# EAGLE design BoardAttiny (EAGLE 9.4.1)
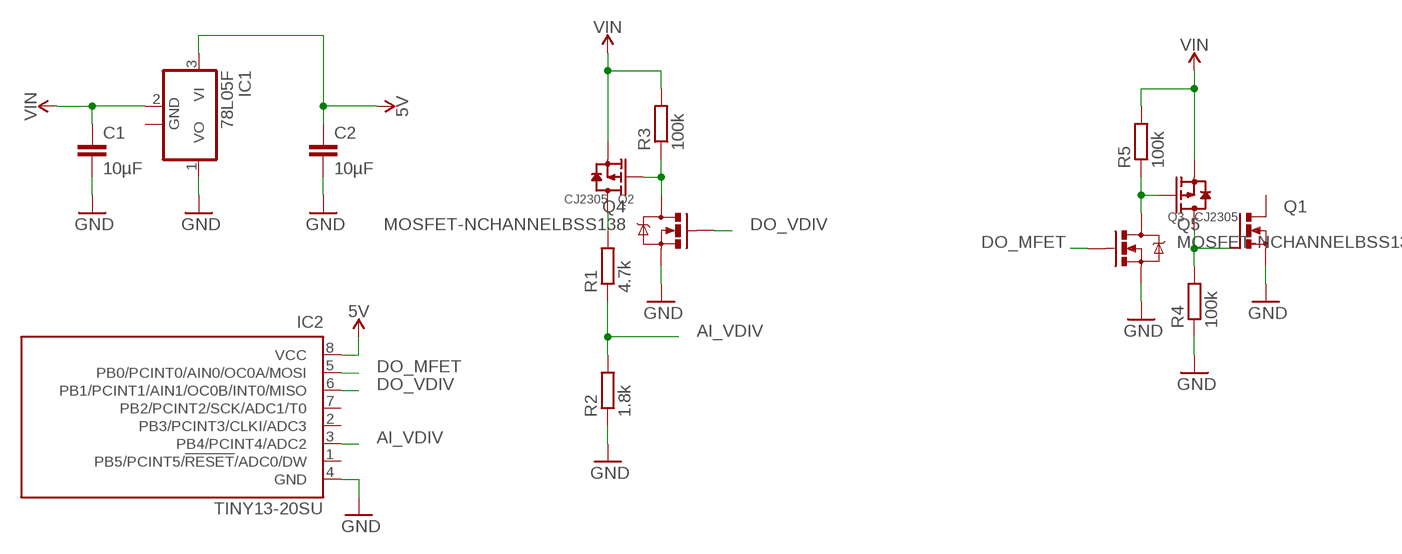
[diagram p0: schematic, sheet 1]

## Parts
C1  10µF  C-EUC0805  [C0805]
C2  10µF  C-EUC0805  [C0805]
IC1  78L05F  [SOT89]
IC2  TINY13-20SU  [8S2]
Q1  PMOSFET_NTO220BH  [TO220BH]
Q2  CJ2305  SMD-MOSFET-P-CH-8V-4.1A-CJ2305(SOT-23)  [SOT-23]
Q3  CJ2305  SMD-MOSFET-P-CH-8V-4.1A-CJ2305(SOT-23)  [SOT-23]
Q4  MOSFET-NCHANNELBSS138  [SOT23]
Q5  MOSFET-NCHANNELBSS138  [SOT23]
R1  4.7k  R-EU_R0805  [R0805]
R2  1.8k  R-EU_R0805  [R0805]
R3  100k  R-EU_R0805  [R0805]
R4  100k  R-EU_R0805  [R0805]
R5  100k  R-EU_R0805  [R0805]

## Nets
5V: C2.1 IC1.3(VI) IC2.8(VCC)
AI_VDIV: IC2.3(PB4/PCINT4/ADC2) R1.1 R2.2
DO_MFET: IC2.5(PB0/PCINT0/AIN0/OC0A/MOSI) Q5.1(G)
DO_VDIV: IC2.6(PB1/PCINT1/AIN1/OC0B/INT0/MISO) Q4.1(G)
GND: C1.2 C2.2 IC1.1(VO) IC2.4(GND) Q1.S Q4.2(S) Q5.2(S) R2.1 R4.1
N$1: Q2.3(D) R1.2
N$2: Q2.1(G) Q4.3(D) R3.1
N$3: Q3.1(G) Q5.3(D) R5.1
N$4: Q1.G Q3.3(D) R4.2
VIN: C1.1 IC1.2(GND) Q2.2(S) Q3.2(S) R3.2 R5.2
Unconnected: IC1.2@1(GND) IC2.1(PB5/PCINT5/!RESET!/ADC0/DW) IC2.2(PB3/PCINT3/CLKI/ADC3) IC2.7(PB2/PCINT2/SCK/ADC1/T0) Q1.D

## Library data of the parts
C1 C2 = rcl:C-EU: CAPACITOR, European symbol; SPICEPREFIX: C
IC1 = linear:78L*: POSITOIV-VOLTAGE REGULATORS Output up to 100 mA Source: Datasheet <http://focus.ti.com/lit/ds/symlink/ua78l05.pdf>
IC2 = atmel:TINY13: 8-bit AVR Microcontroller with 1K Bytes In-System Programmable Flash Source: http://www.atmel.com/dyn/resources/prod_documents/2535S.pdf; MPN: ATTINY13-20SU; OC_FARNELL: 9171568; OC_NEWARK: 96K6522
Q1 = transistor-power:PMOSFET_N: Power MOSFET N-Channel
Q2 Q3 = OPL_Discrete_Semiconductor:SMD-MOSFET-P-CH-8V-4.1A-CJ2305(SOT-23): 305030014; MPN: CJ2305
Q4 Q5 = BeagleBone_Blue_R3:MOSFET-NCHANNEL: Common NMOSFET Parts MFG P/N Store ID Prod ID FDD8780 TRANS-09984 SI7820DN TRANS-11055 FDS6630A IC-08089 2N7002PW TRANS-11151 FQP30N06L COM-10213 TRANS-10060 BSS123LT1G TRANS-08345 BSS138 TRANS-00830 BS170 2N7000; PROD_ID: TRANS-00830
R1-R5 = rcl:R-EU_: RESISTOR, European symbol; SPICEPREFIX: R

## Board
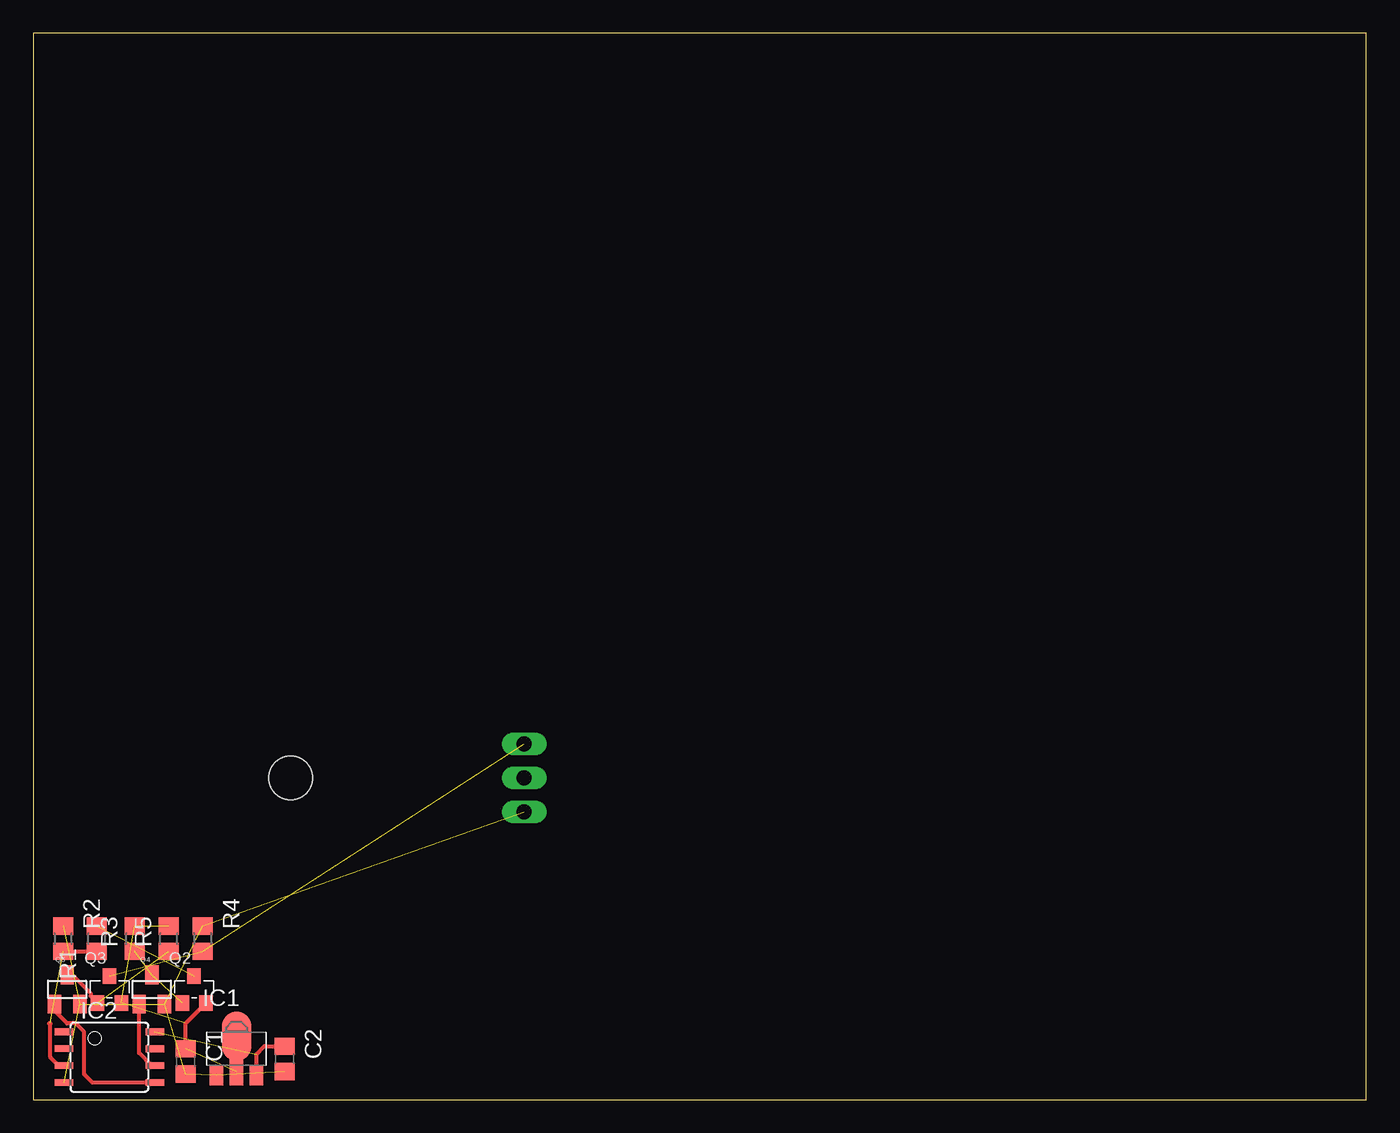
[diagram p1: board, top side]
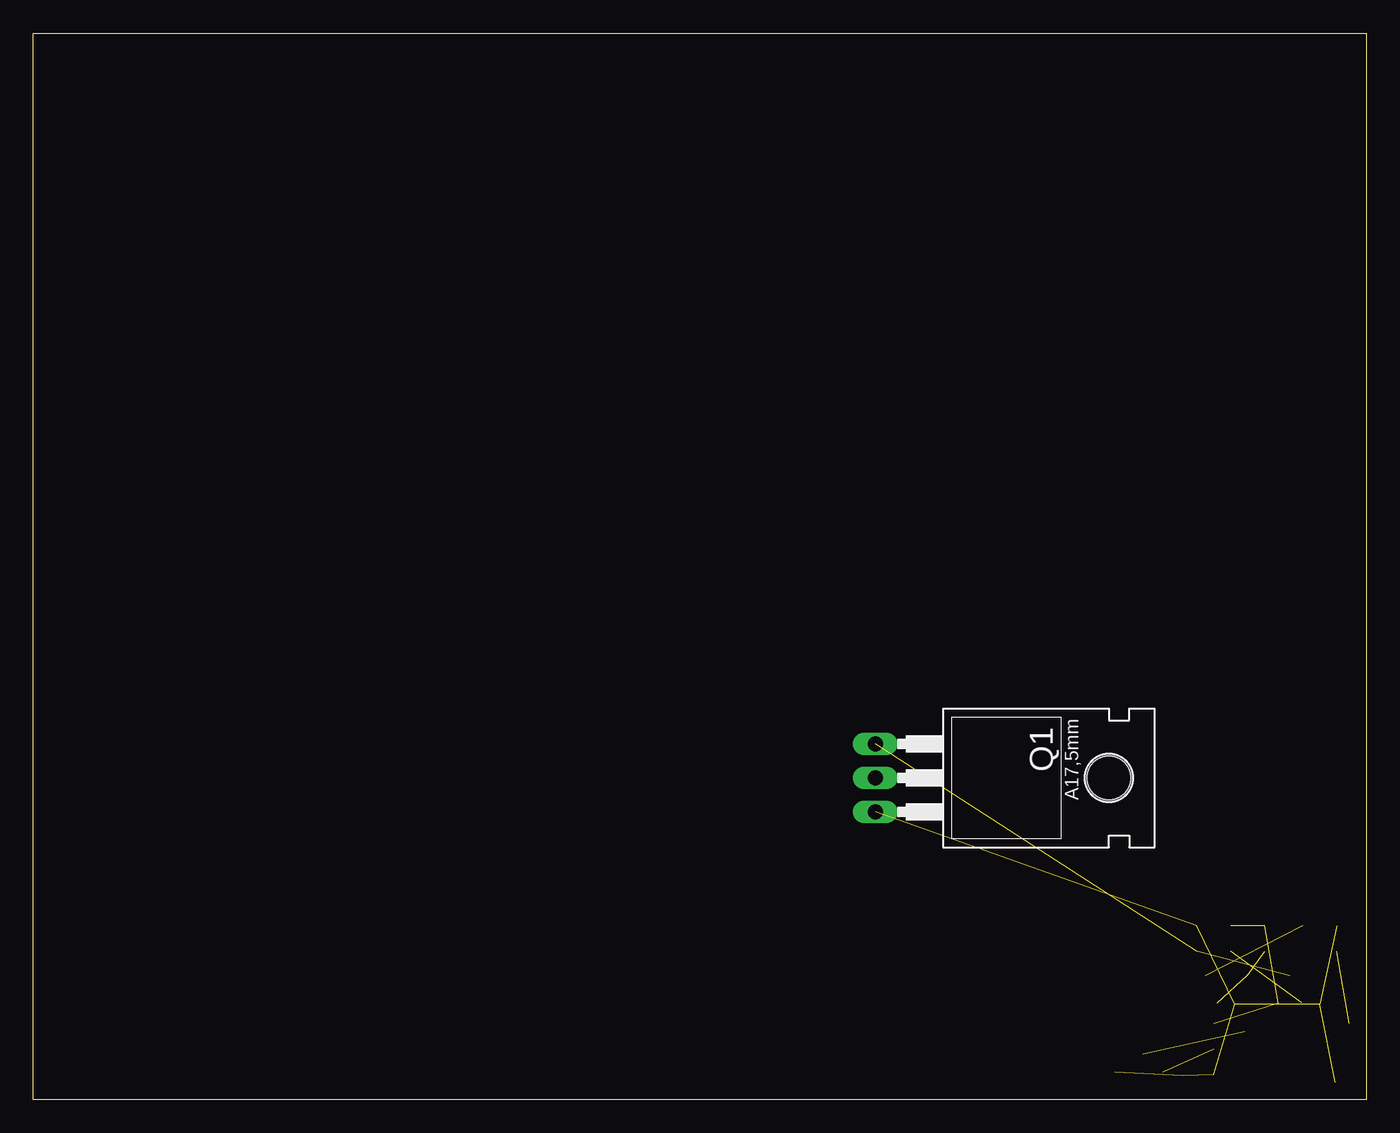
[diagram p2: board, bottom side, seen from below]

Size 100 x 80 mm. Coordinates in mm from the lower left corner, seen from the top.
Outline: 0,0 100,0 100,80 0,80 0,0
Copper layers (1*16): Top 0.035mm / dielectric 1.5mm / Bottom 0.035mm
Design rules "default": minimum track width 6mil, minimum drill 0.35mm, track to track 6mil, track to pad 6mil, pad to pad 6mil, via to via 6mil, smd to smd 6mil, copper to edge 40mil, drill to drill 6mil, minimum pad ring 10mil, minimum via ring 8mil, stop-mask expansion 4mil, vias tented up to drill 0mil, thermal gap 10mil

### Footprints (pad centres in the part's own frame; a part is rotated, then mirrored left to right if it is on the bottom)
C0805 = smd 1.3 x 1.5: 1 -0.95,0; 2 0.95,0
SOT89 = smd 1 x 1.5: 1 -1.499,-1.981; 3 1.499,-1.981 | smd 1 x 2: 2 0,-1.727 | smd 2.2 x 3.7: 2@1 0,0.94
8S2 = smd 0.5 x 1.4: 1 -1.905,-3.404; 2 -0.645,-3.404; 3 0.625,-3.404; 4 1.895,-3.404; 5 1.905,3.404; 6 0.635,3.404; 7 -0.635,3.404; 8 -1.905,3.404
TO220BH = drill 1.118 long: D 0,-6.35; G -2.54,-6.35; S 2.54,-6.35 | hole 3.302: 0,11.176
SOT-23 = smd 1.016 x 1.143: 1 -0.889,-1.016; 2 0.889,-1.016; 3 0,1.016
SOT23 = smd 1 x 1.4: 1 -0.95,-1.1; 2 0.95,-1.1; 3 0,1.1
R0805 = smd 1.3 x 1.5: 1 -0.95,0; 2 0.95,0

### Placement (x,y rotation side)
C1  11.43,2.85 270 top
C2  18.86,3.05 270 top
IC1  15.24,3.81 0 top
IC2  5.71,3.17 270 top
Q1  30.48,24.13 270 bottom
Q2  12.06,8.26 0 top
Q3  5.71,8.26 0 top
Q4  8.89,8.26 0 top
Q5  2.54,8.26 0 top
R1  4.76,12.06 90 top
R2  2.23,12.06 270 top
R3  7.62,12.06 90 top
R4  12.7,12.06 270 top
R5  10.16,12.06 90 top

### Tracks (layer width: path | path; a pad name or v marks a point on that pad's centre or on a via)
5V  (1 unrouted)
  Top 0.305: IC1.3 16.74,3.4 17.33,4 C2.1
AI_VDIV  (1 unrouted)
  Top 0.305: R2.2 R1.1 | IC2.3 1.9,2.55 1.27,3.17 1.27,5.71 1.17,5.71
DO_MFET
  Top 0.305: IC2.5 6.99,1.27 6.35,1.27 4.45,1.27 3.81,1.91 3.81,5.08 3.17,5.71 2.54,5.71 1.59,6.67 Q5.1
DO_VDIV
  Top 0.305: IC2.6 8.89,2.54 7.94,3.49 Q4.1
GND  (8 unrouted)
N$1  (1 unrouted)
N$2  (2 unrouted)
N$3  (1 unrouted)
  Top 0.305: Q3.1 4.29,7.77 4.29,7.98 2.92,9.36 Q5.3
N$4  (2 unrouted)
VIN  (4 unrouted)
  Top 0.305: C1.1 11.43,5.71 Q2.2